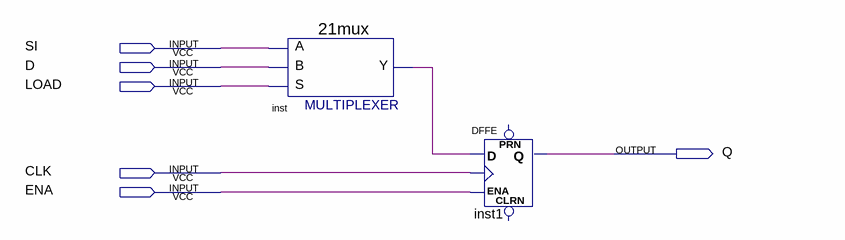
[diagram p0: schematic sheet]
// Quartus schematic scell.bdf as structural Verilog: 2 symbols, 6 pins
module scell (
  input  SI,
  input  D,
  input  LOAD,
  input  CLK,
  input  ENA,
  output Q
);

  wire inst_y;

  \21mux  inst (.S(LOAD), .B(D), .A(SI), .Y(inst_y));
  DFFE inst1 (.D(inst_y), .CLK(CLK), .ENA(ENA), .Q(Q));  // open: PRN, CLRN
endmodule
